# EAGLE design LiIonLader_1ZelleMax500mA (EAGLE 7.1.0)
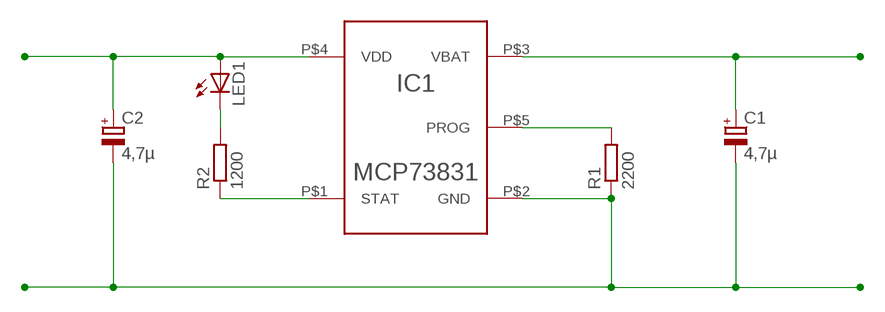
[diagram p0: schematic, sheet 1]

## Parts
C1  4,7µ  CPOL-EUE1.8-4  [E1,8-4]
C2  4,7µ  CPOL-EUE1.8-4  [E1,8-4]
IC1  MCP73831  [SOT-23-5]
LED1  LED3MM  [LED3MM]
R1  2200  R-EU_0204/5  [0204/5]
R2  1200  R-EU_0204/5  [0204/5]

## Nets
GND: C1.- C2.- IC1.P$2(GND) R1.1
N$2: LED1.K(C) R2.2
PROG: IC1.P$5(PROG) R1.2
STAT: IC1.P$1(STAT) R2.1
VBAT: C1.+ IC1.P$3(VBAT)
VDD: C2.+ IC1.P$4(VDD) LED1.A

## Library data of the parts
C1 C2 = rcl:CPOL-EU: POLARIZED CAPACITOR, European symbol
IC1 = Own_misc:MCP73831
LED1 = led:LED: LED OSRAM: - CHIPLED LG R971, LG N971, LY N971, LG Q971, LY Q971, LO R971, LY R971 LH N974, LH R974 LS Q976, LO Q976, LY Q976 LO Q996 - Hyper CHIPLED LW Q18S LB Q993, LB Q99A, LB R99A - SideLED LS A670, LO A670, LY A670, LG A670, LP A670 LB A673, LV A673, LT A673, LW A673 LH A674 LY A675 LS A676, LA A676, LO A676, LY A676, LW A676 LS A679, LY A679, LG A679 - Hyper Micro SIDELED® LS Y876, LA Y876, LO Y876, LY Y876 LT Y87S - SmartLED LW L88C, LW L88S LB L89C, LB L89S, LG L890 LS L89K, LO L89K, LY L89K LS L896, LA L896, LO L896, LY L896 - TOPLED LS T670, LO T670, LY T670, LG T670, LP T670 LSG T670, LSP T670, LSY T670, LOP T670, LYG T670 LG T671, LOG T671, LSG T671 LB T673, LV T673, LT T673, LW T673 LH T674 LS T676, LA T676, LO T676, LY T676, LB T676, LH T676, LSB T676, LW T676 LB T67C, LV T67C, LT T67C, LS T67K, LO T67K, LY T67K, LW E67C LS E67B, LA E67B, LO E67B, LY E67B, LB E67C, LV E67C, LT E67C LW T67C LS T679, LY T679, LG T679 LS T770, LO T770, LY T770, LG T770, LP T770 LB T773, LV T773, LT T773, LW T773 LH T774 LS E675, LA E675, LY E675, LS T675 LS T776, LA T776, LO T776, LY T776, LB T776 LHGB T686 LT T68C, LB T68C - Hyper Mini TOPLED® LB M676 - Mini TOPLED Santana® LG M470 LS M47K, LO M47K, LY M47K Source: http://www.osram.convergy.de LUXEON: - LUMILED® LXK2-PW12-R00, LXK2-PW12-S00, LXK2-PW14-U00, LXK2-PW14-V00 LXK2-PM12-R00, LXK2-PM12-S00, LXK2-PM14-U00 LXK2-PE12-Q00, LXK2-PE12-R00, LXK2-PE12-S00, LXK2-PE14-T00, LXK2-PE14-U00 LXK2-PB12-K00, LXK2-PB12-L00, LXK2-PB12-M00, LXK2-PB14-N00, LXK2-PB14-P00, LXK2-PB14-Q00 LXK2-PR12-L00, LXK2-PR12-M00, LXK2-PR14-Q00, LXK2-PR14-R00 LXK2-PD12-Q00, LXK2-PD12-R00, LXK2-PD12-S00 LXK2-PH12-R00, LXK2-PH12-S00 LXK2-PL12-P00, LXK2-PL12-Q00, LXK2-PL12-R00 Source: www.luxeon.com KINGBRIGHT: KA-3528ASYC Source: www.kingbright.com
R1 R2 = rcl:R-EU_: RESISTOR, European symbol

## Board
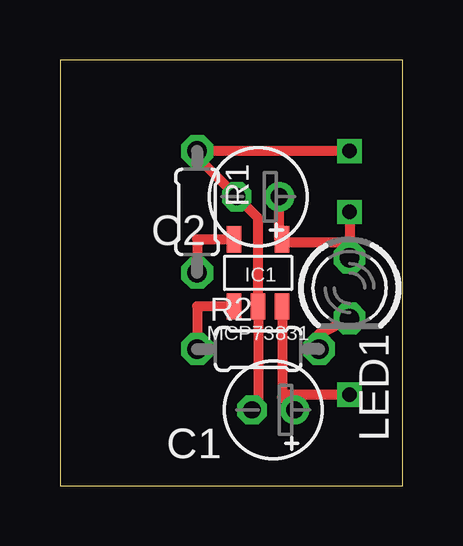
[diagram p1: board, top side]

Size 14.27 x 17.77 mm. Coordinates in mm from the lower left corner, seen from the top.
Outline: 0,0 14.27,0 14.27,17.77 0,17.77 0,0
Copper layers (1*16): Top 0.035mm / dielectric 1.5mm / Bottom 0.035mm
Design rules "default": minimum track width 10mil, minimum drill 24mil, track to track 8mil, track to pad 8mil, pad to pad 8mil, via to via 8mil, smd to smd 8mil, copper to edge 40mil, drill to drill 8mil, minimum pad ring 10mil, minimum via ring 8mil, stop-mask expansion 4mil, vias tented up to drill 0mil, thermal gap 10mil

### Footprints (pad centres in the part's own frame; a part is rotated, then mirrored left to right if it is on the bottom)
E1,8-4 = drill 0.711 pad 1.168: + -0.889,0 | drill 0.711 pad 1.168 octagon: - 0.889,0
SOT-23-5 = smd 0.6 x 1.1: P$1 -1,-1.4; P$2 0,-1.4; P$3 1,-1.4; P$4 1,1.4; P$5 -1,1.4
LED3MM = drill 0.813 octagon: A -1.27,0; K 1.27,0
0204/5 = drill 0.813 octagon: 1 -2.54,0; 2 2.54,0

### Placement (x,y rotation side)
C1  8.89,3.17 180 top
C2  8.25,12.06 180 top
IC1  8.25,8.89 0 top
LED1  12.06,8.25 270 top
R1  5.71,11.43 270 top
R2  8.25,5.71 0 top

### Tracks (layer width: path | path; a pad name or v marks a point on that pad's centre or on a via)
GND  (via drill 0.6)
  Top 0.406: C1.- 8.25,3.43 IC1.P$2 8.25,11.18 C2.- 5.71,13.72 R1.1 v12.06,13.97
N$2
  Top 0.406: R2.2 10.8,6.35 LED1.K
PROG
  Top 0.406: IC1.P$5 5.71,10.29 R1.2
STAT
  Top 0.406: IC1.P$1 5.71,7.49 R2.1
VBAT  (via drill 0.6)
  Top 0.406: IC1.P$3 9.25,3.7 9.34,3.62 | 9.34,3.62 C1.+ | v12.06,3.81 9.52,3.81 9.34,3.62
VDD  (via drill 0.6)
  Top 0.406: C2.+ 9.14,10.29 IC1.P$4 9.38,10.16 12.06,10.16 | v12.06,11.43 12.06,10.16 | LED1.A 12.06,10.16